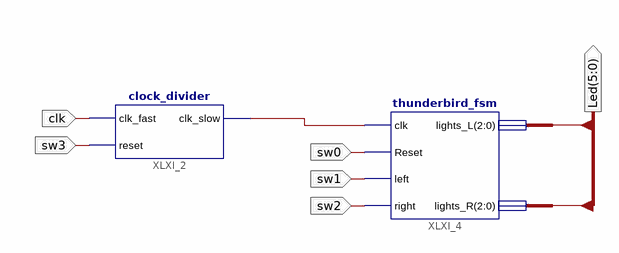
[diagram p0: schematic sheet 1]
// Xilinx ISE schematic Top.sch (spartan3e) as structural Verilog: 2 symbols, 6 ports
module Top (
  input  sw0,
  input  sw1,
  input  sw2,
  input  clk,
  input  sw3,
  output [5:0] Led
);

  wire XLXN_1;

  clock_divider XLXI_2 (.clk_fast(clk), .reset(sw3), .clk_slow(XLXN_1));
  thunderbird_fsm XLXI_4 (.clk(XLXN_1), .Reset(sw0), .left(sw1), .right(sw2), .lights_L(Led[5:3]), .lights_R(Led[2:0]));
endmodule
